# EAGLE schematic PCCAR_16003-1B (EAGLE 9.6.2)
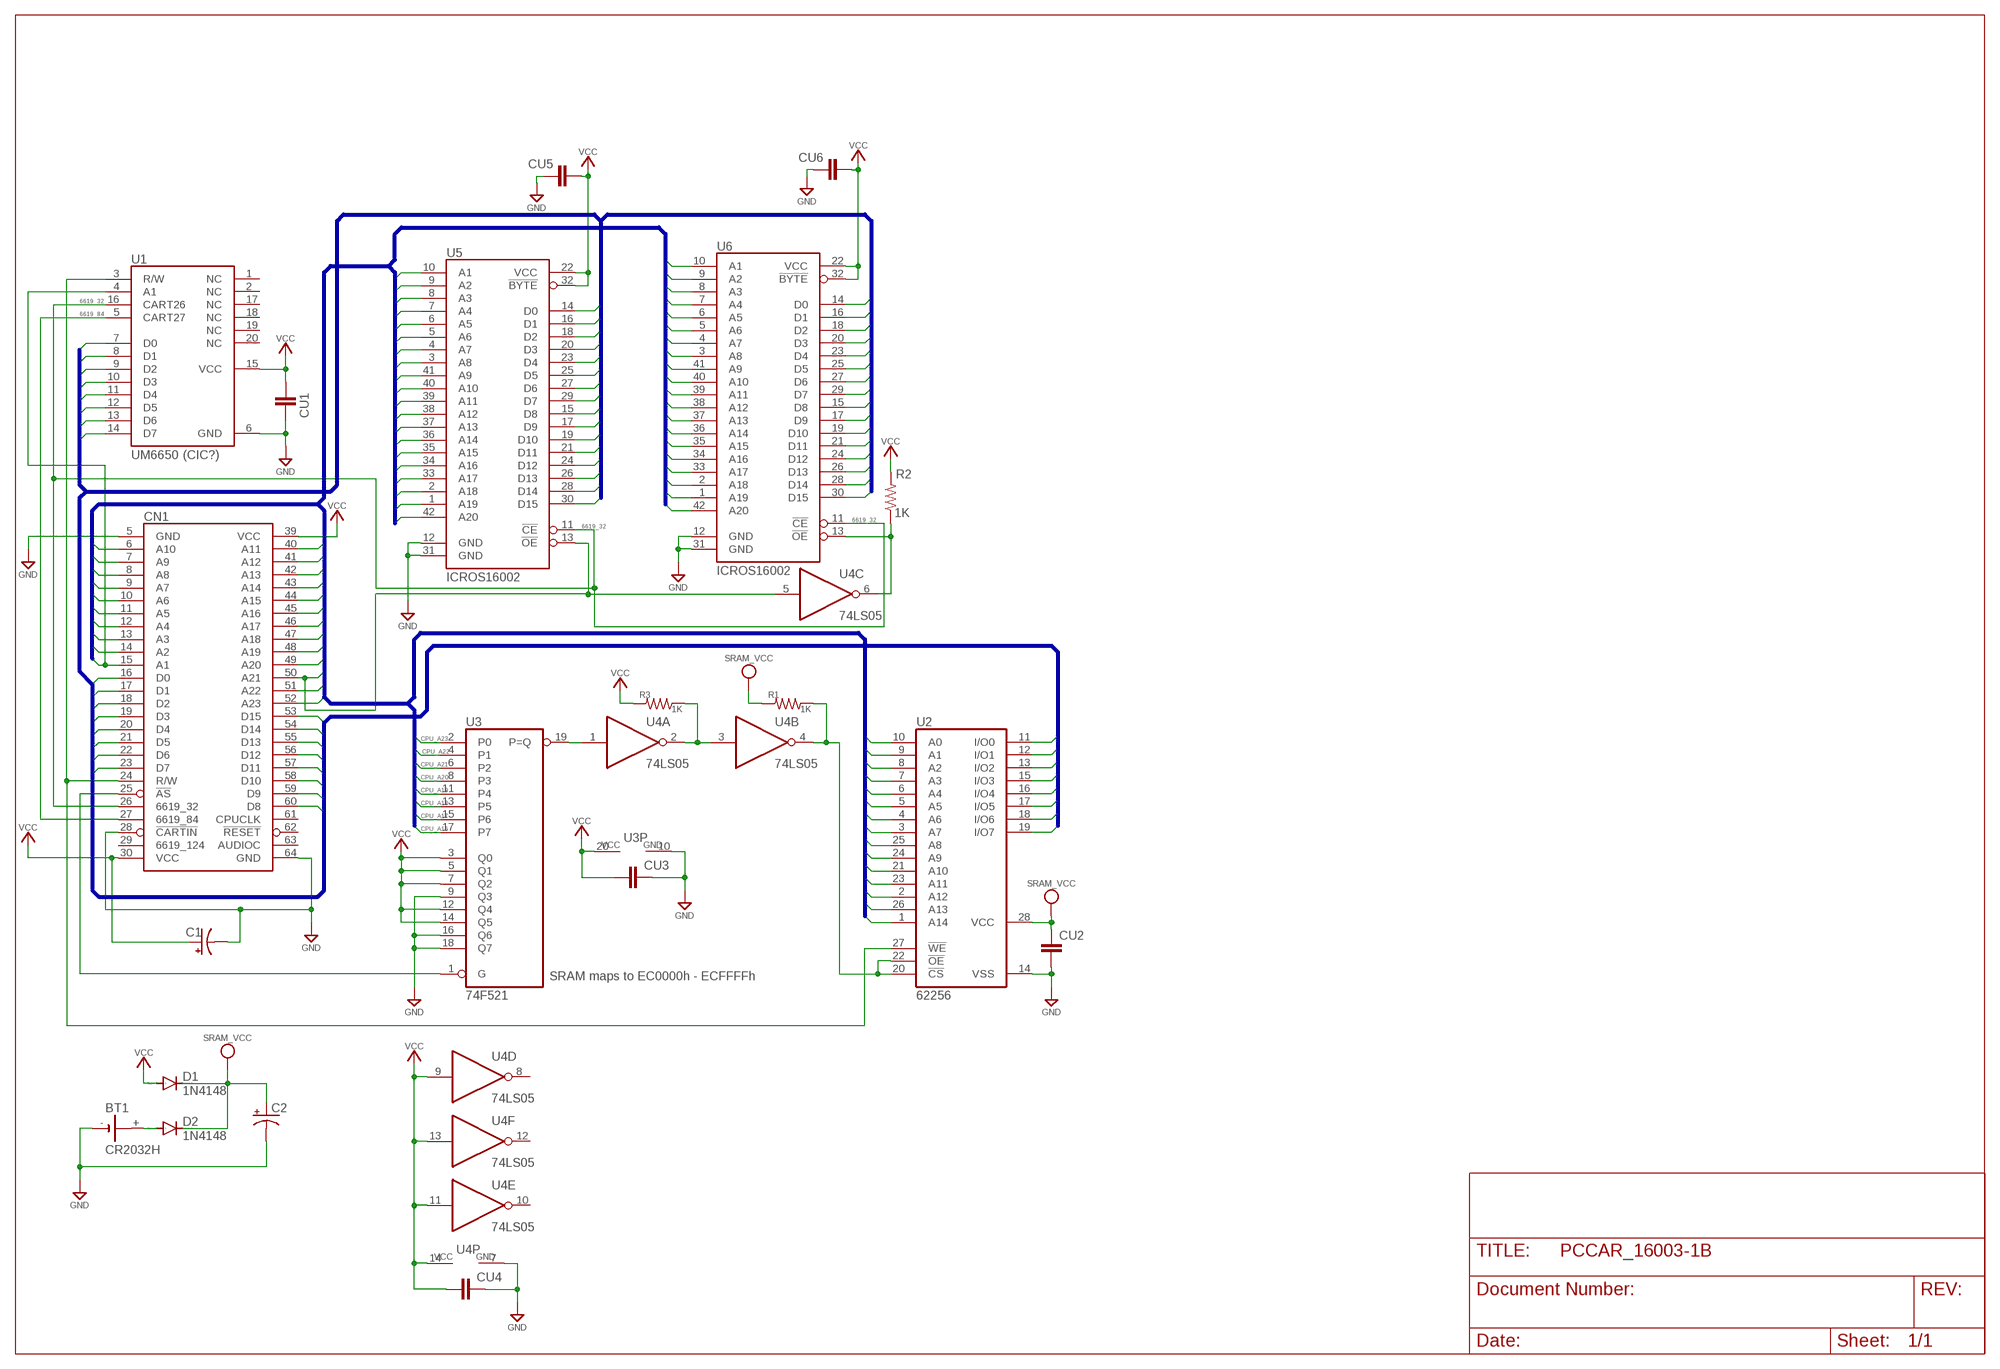
[diagram p0: schematic, sheet 1]

## Parts
BT1  CR2032H  [CR2032H]
C1  CPOL-USE2.5-6  [E2,5-6]
C2  CPOL-USE2.5-6  [E2,5-6]
CN1  CARTRIDGE_PCB_52P  [CARTRIDGE_PCB_52P]
CU1  C-EUC0805  [C0805]
CU2  C-EUC0805  [C0805]
CU3  C-EUC0805  [C0805]
CU4  C-EUC0805  [C0805]
CU5  C-EUC0805  [C0805]
CU6  C-EUC0805  [C0805]
D1  1N4148  1N4148DO35-7  [DO35-7]
D2  1N4148  1N4148DO35-7  [DO35-7]
R1  1K  R-US_0204/7  [0204/7]
R2  1K  R-US_0204/7  [0204/7]
R3  1K  R-US_0204/7  [0204/7]
U1  UM6650  [DIL20]
U2  62256  62256P  [DIL28-6]
U3  74F521  74HC688N  [DIL20]
U4  74LS05  74LS05N  [DIL14]
U5  ICROS16002  [DIL42]
U6  ICROS16002  [DIL42]

## Nets
6619_32: CN1.26(6619_32) U1.16(CART26) U5.11(!CE) U6.11(!CE)
6619_84: CN1.27(6619_84) U1.5(CART27)
CPU_A1: CN1.15(A1) U1.4(A1) U2.10(A0) U5.10(A1) U6.10(A1)
CPU_A2: CN1.14(A2) U2.9(A1) U5.9(A2) U6.9(A2)
CPU_A3: CN1.13(A3) U2.8(A2) U5.8(A3) U6.8(A3)
CPU_A4: CN1.12(A4) U2.7(A3) U5.7(A4) U6.7(A4)
CPU_A5: CN1.11(A5) U2.6(A4) U5.6(A5) U6.6(A5)
CPU_A6: CN1.10(A6) U2.5(A5) U5.5(A6) U6.5(A6)
CPU_A7: CN1.9(A7) U2.4(A6) U5.4(A7) U6.4(A7)
CPU_A8: CN1.8(A8) U2.3(A7) U5.3(A8) U6.3(A8)
CPU_A9: CN1.7(A9) U2.25(A8) U5.41(A9) U6.41(A9)
CPU_A10: CN1.6(A10) U2.24(A9) U5.40(A10) U6.40(A10)
CPU_A11: CN1.40(A11) U2.21(A10) U5.39(A11) U6.39(A11)
CPU_A12: CN1.41(A12) U2.23(A11) U5.38(A12) U6.38(A12)
CPU_A13: CN1.42(A13) U2.2(A12) U5.37(A13) U6.37(A13)
CPU_A14: CN1.43(A14) U2.26(A13) U5.36(A14) U6.36(A14)
CPU_A15: CN1.44(A15) U2.1(A14) U5.35(A15) U6.35(A15)
CPU_A16: CN1.45(A16) U3.17(P7) U5.34(A16)
CPU_A17: CN1.46(A17) U3.15(P6) U5.33(A17) U6.33(A17) U6.34(A16)
CPU_A18: CN1.47(A18) U3.13(P5) U5.2(A18) U6.2(A18)
CPU_A19: CN1.48(A19) U3.11(P4) U5.1(A19) U6.1(A19)
CPU_A20: CN1.49(A20) U3.8(P3) U5.42(A20) U6.42(A20)
CPU_A21: CN1.50(A21) U3.6(P2) U4.5(C:I) U5.13(!OE)
CPU_A22: CN1.51(A22) U3.4(P1)
CPU_A23: CN1.52(A23) U3.2(P0)
CPU_D0: CN1.16(D0) U1.7(D0) U2.11(I/O0) U5.14(D0) U6.14(D0)
CPU_D1: CN1.17(D1) U1.8(D1) U2.12(I/O1) U5.16(D1) U6.16(D1)
CPU_D2: CN1.18(D2) U1.9(D2) U2.13(I/O2) U5.18(D2) U6.18(D2)
CPU_D3: CN1.19(D3) U1.10(D3) U2.15(I/O3) U5.20(D3) U6.20(D3)
CPU_D4: CN1.20(D4) U1.11(D4) U2.16(I/O4) U5.23(D4) U6.23(D4)
CPU_D5: CN1.21(D5) U1.12(D5) U2.17(I/O5) U5.25(D5) U6.25(D5)
CPU_D6: CN1.22(D6) U1.13(D6) U2.18(I/O6) U5.27(D6) U6.27(D6)
CPU_D7: CN1.23(D7) U1.14(D7) U2.19(I/O7) U5.29(D7) U6.29(D7)
CPU_D8: CN1.60(D8) U5.15(D8) U6.15(D8)
CPU_D9: CN1.59(D9) U5.17(D9) U6.17(D9)
CPU_D10: CN1.58(D10) U5.19(D10) U6.19(D10)
CPU_D11: CN1.57(D11) U5.21(D11) U6.21(D11)
CPU_D12: CN1.56(D12) U5.24(D12) U6.24(D12)
CPU_D13: CN1.55(D13) U5.26(D13) U6.26(D13)
CPU_D14: CN1.54(D14) U5.28(D14) U6.28(D14)
CPU_D15: CN1.53(D15) U5.30(D15) U6.30(D15)
GND: BT1.- C1.- C2.- CN1.5(GND) CN1.28(!CARTIN) CN1.64(GND) CU1.2 CU2.2 CU3.2 CU4.2 CU5.1 CU6.1 U1.6(GND) U2.14(VSS) U3.9(Q3) U3.10(GND) U3.16(Q6) U3.18(Q7) U4.7(P:GND) U5.12(GND) U5.31(GND) U6.12(GND) U6.31(GND)
N$1: CN1.25(!AS) U3.1(G)
N$2: U3.19(P=Q) U4.1(A:I)
N$3: R3.1 U4.2(A:O) U4.3(B:I)
N$5: R1.1 U2.20(!CS) U2.22(!OE) U4.4(B:O)
N$8: CN1.24(R/W) U1.3(R/W) U2.27(!WE)
N$9: BT1.+ D2.A
N$12: R2.1 U4.6(C:O) U6.13(!OE)
SRAM_VCC: C2.+ CU2.1 D1.C D2.C R1.2 U2.28(VCC)
VCC: C1.+ CN1.30(VCC) CN1.39(VCC) CU1.1 CU3.1 CU4.1 CU5.2 CU6.2 D1.A R2.2 R3.2 U1.15(VCC) U3.3(Q0) U3.5(Q1) U3.7(Q2) U3.12(Q4) U3.14(Q5) U3.20(VCC) U4.9(D:I) U4.11(E:I) U4.13(F:I) U4.14(P:VCC) U5.22(VCC) U5.32(!BYTE) U6.22(VCC) U6.32(!BYTE)
Unconnected: BT1.+@1(+) CN1.29(6619_124) CN1.61(CPUCLK) CN1.62(!RESET) CN1.63(AUDIOC) U1.1(NC) U1.2(NC) U1.17(NC) U1.18(NC) U1.19(NC) U1.20(NC) U4.8(D:O) U4.10(E:O) U4.12(F:O)

## Buses
CPU_D[0..15]
CPU_A[1..23]

## Notes on the sheet
- (CIC?)
- SRAM maps to EC0000h - ECFFFFh

## Library data of the parts
BT1 = battery:CR2032H: LI BATTERY Varta
C1 C2 = rcl:CPOL-US: POLARIZED CAPACITOR, American symbol; SPICEPREFIX: C
CN1 = acan:CARTRIDGE_PCB_52P: Cartridge PCB 52P
CU1-CU6 = rcl:C-EU: CAPACITOR, European symbol; SPICEPREFIX: C
D1 D2 = diode:1N4148: DIODE high speed (Philips)
R1-R3 = rcl:R-US_: RESISTOR, American symbol; SPICEPREFIX: R
U1 = acan:UM6650: UM6650
U2 = memory-hitachi:62256P: MEMORY; OC_FARNELL: unknown; OC_NEWARK: unknown
U3 = 74xx-eu:74*688: 8-bit MAGNITUDE/IDENTITY COMPARATOR, totem pole
U4 = 74xx-eu:74*05: Hex INVERTER, open collector
U5 U6 = acan:ICROS16002: 16Mbits Mask Rom in cartridge